# Altium schematic sheet ProgrammableAttenuator.SchDoc: Programmable Attenuator
size A4; DrawnBy: Patrik Staudenmayer; DocumentNumber: 15; SheetNumber: 15; SheetTotal: 15
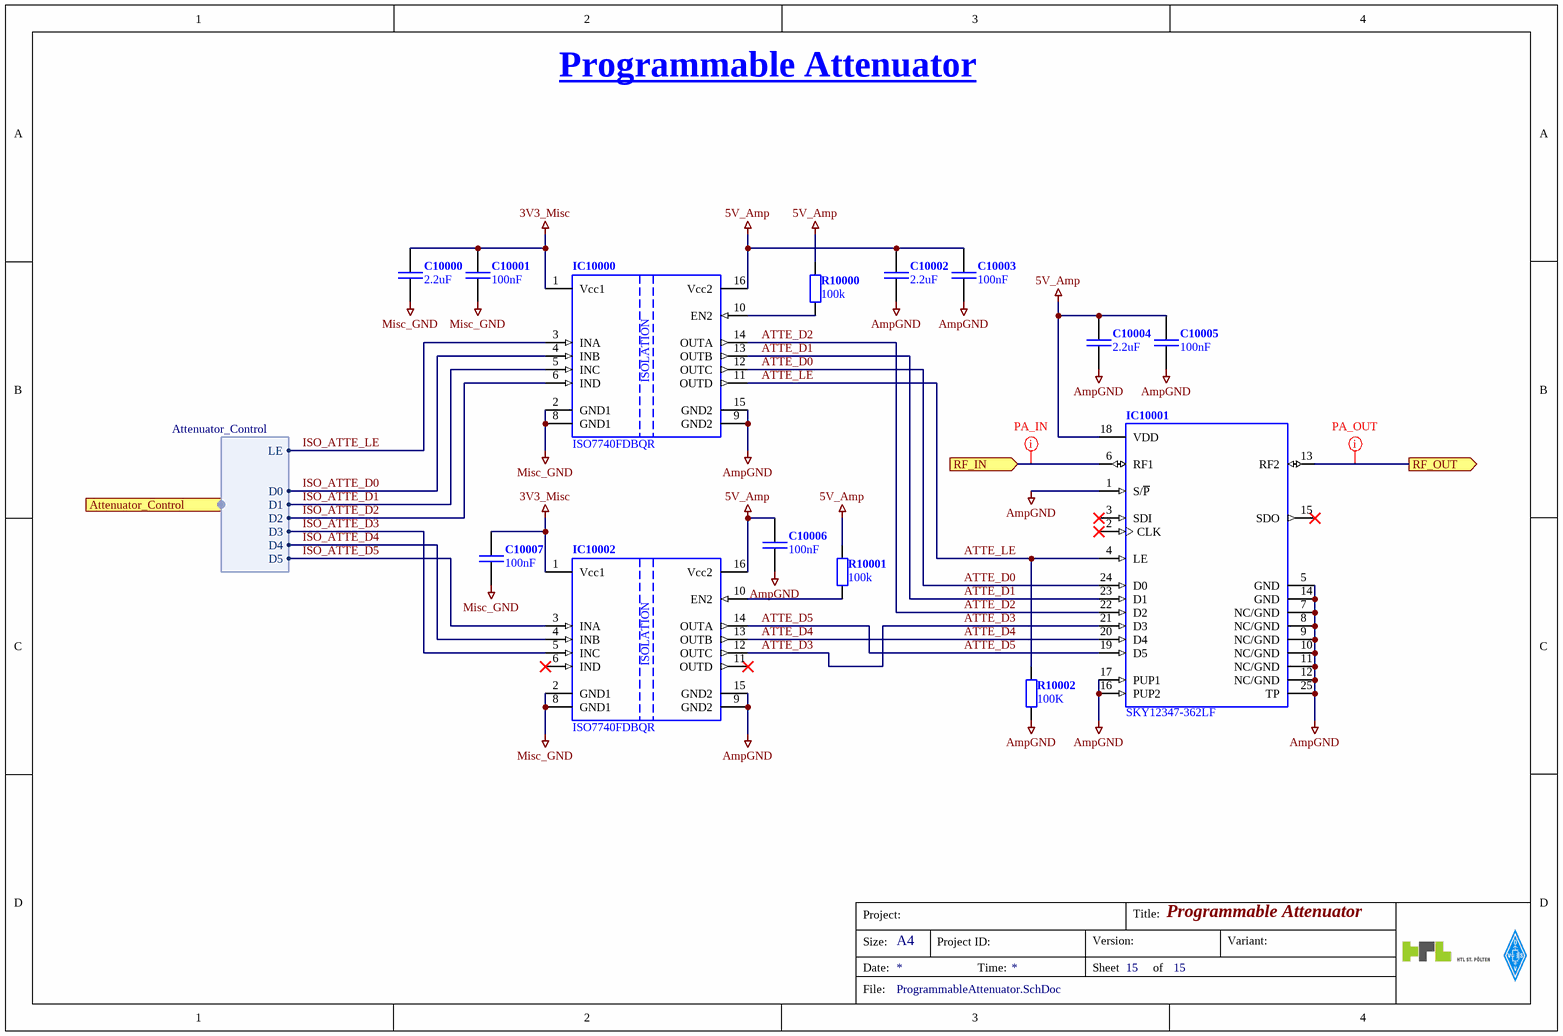
[diagram p0: ProgrammableAttenuator.SchDoc]

## Parts
C10000  2.2uF  [C_0805_N [CAPC2013N IPC]]
C10001  100nF  [C_0603_N [CAPC1608N IPC]]
C10002  2.2uF  [C_0805_N [CAPC2013N IPC]]
C10003  100nF  [C_0603_N [CAPC1608N IPC]]
C10004  2.2uF  [C_0805_N [CAPC2013N IPC]]
C10005  100nF  [C_0603_N [CAPC1608N IPC]]
C10006  100nF  [C_0603_N [CAPC1608N IPC]]
C10007  100nF  [C_0603_N [CAPC1608N IPC]]
IC10000  ISO7740FDBQR  [SOP64P600X175-16N IPC]
IC10001  SKY12347-362LF  [QFN50P400X400X100_HS-25N IPC]
IC10002  ISO7740FDBQR  [SOP64P600X175-16N IPC]
R10000  100k  [R_0603_N [RESC1608N IPC]]
R10001  100k  [R_0603_N [RESC1608N IPC]]
R10002  100K  [R_0603_N [RESC1608N IPC]]

## Ports
Attenuator_Control (out, harness Attenuator_Control), RF_IN (in), RF_OUT (out)

## Harnesses
Attenuator_Control: LE, D0, D1, D2, D3, D4, D5

## Nets
3V3_Misc: C10000.1 C10001.1 C10007.1 IC10000.1(Vcc1) IC10002.1(Vcc1)
5V_Amp: C10002.1 C10003.1 C10004.1 C10005.1 C10006.1 IC10000.16(Vcc2) IC10001.18(VDD) IC10002.16(Vcc2) R10000.2 R10001.2
AmpGND: C10002.2 C10003.2 C10004.2 C10005.2 C10006.2 IC10000.9(GND2) IC10000.15(GND2) IC10001.1(S/~{P}) IC10001.5(GND) IC10001.7(NC/GND) IC10001.8(NC/GND) IC10001.9(NC/GND) IC10001.10(NC/GND) IC10001.11(NC/GND) IC10001.12(NC/GND) IC10001.14(GND) IC10001.16(PUP2) IC10001.17(PUP1) IC10001.25(TP) IC10002.9(GND2) IC10002.15(GND2) R10002.1
Misc_GND: C10000.2 C10001.2 C10007.2 IC10000.2(GND1) IC10000.8(GND1) IC10002.2(GND1) IC10002.8(GND1)
ATTE_D0: IC10000.12(OUTC) IC10001.24(D0)
ATTE_D1: IC10000.13(OUTB) IC10001.23(D1)
ATTE_D2: IC10000.14(OUTA) IC10001.22(D2)
ATTE_D3: IC10001.21(D3) IC10002.12(OUTC)
ATTE_D4: IC10001.20(D4) IC10002.13(OUTB)
ATTE_D5: IC10001.19(D5) IC10002.14(OUTA)
ATTE_LE: IC10000.11(OUTD) IC10001.4(LE) R10002.2
ISO_ATTE_D0: IC10000.4(INB) ; port Attenuator_Control.D0
ISO_ATTE_D1: IC10000.5(INC) ; port Attenuator_Control.D1
ISO_ATTE_D2: IC10000.6(IND) ; port Attenuator_Control.D2
ISO_ATTE_D3: IC10002.5(INC) ; port Attenuator_Control.D3
ISO_ATTE_D4: IC10002.4(INB) ; port Attenuator_Control.D4
ISO_ATTE_D5: IC10002.3(INA) ; port Attenuator_Control.D5
ISO_ATTE_LE: IC10000.3(INA) ; port Attenuator_Control.LE
RF_IN: IC10001.6(RF1) ; port RF_IN
RF_OUT: IC10001.13(RF2) ; port RF_OUT
NetIC10000_10: IC10000.10(EN2) R10000.1
NetIC10002_10: IC10002.10(EN2) R10001.1

Not connected (* = marked no-connect by the designer): IC10001 2(CLK)* 3(SDI)* 15(SDO)*; IC10002 6(IND)* 11(OUTD)*

## Layout directives
rule Width Constraint [Pref Impedance = 50.00ohms    Min Impedance = 50.00ohms    Max Impedance = 50.00ohms]: RF_IN, RF_OUT

## Notes on the sheet
- Programmable Attenuator
- Project:
- Title:
- Size:
- Date:
- A4
- Project ID:
- Time:
- Sheet
- Version:
- of
- Variant:
- File:
- (in symbol IC_ISO7740FDBQR) ISOLATION

## Library data of the parts
C10000-C10007 = C_GENERIC: Prometheus_ID: *; Prometheus_Manufacturer: *
  C10000 C10002 C10004: Prometheus_ManPartNo: 2.2uF; Prometheus_Comment: 2.2uF; Prometheus_CurrentFootprint: C_0805_N [CAPC2013N IPC]
  C10001 C10003 C10005-C10007: Prometheus_ManPartNo: 100nF; Prometheus_Comment: 100nF; Prometheus_CurrentFootprint: C_0603_N [CAPC1608N IPC]
IC10000 IC10002 = IC_ISO7740FDBQR: High-Speed, Robust-EMC Reinforced Quad-Channel Digital Isolators / 100 Mbps data rate / Vcc: 2.25 V ... 5.5 V / 2.25 V to 5.5 V level translation; Prometheus_Manufacturer: Texas Instruments; Prometheus_ManPartNo: ISO7740FDBQR; Prometheus_Comment: ISO7740FDBQR; Prometheus_CurrentFootprint: SOP64P600X175-16N IPC; DatasheetURL: https://www.ti.com/lit/ds/symlink/iso7742.pdf
IC10001 = IC_SKY12347-362LF: Six-Bit Digital Attenuator / Attenuation: 0.5 dB ... 31.5 dB / Serial or Parallel Driver; Prometheus_Manufacturer: Skyworks; Prometheus_ManPartNo: SKY12347-362LF; Prometheus_Comment: SKY12347-362LF; Prometheus_CurrentFootprint: QFN50P400X400X100_HS-25N IPC; DatasheetURL: https://www.skyworksinc.com/-/media/SkyWorks/Documents/Products/501-600/201371B.pdf
R10000-R10002 = R_GENERIC_DIN: Prometheus_ID: *; Prometheus_Manufacturer: *; Prometheus_CurrentFootprint: R_0603_N [RESC1608N IPC]
  R10000 R10001: Prometheus_ManPartNo: 100k; Prometheus_Comment: 100k
  R10002: Prometheus_ManPartNo: 100K; Prometheus_Comment: 100K